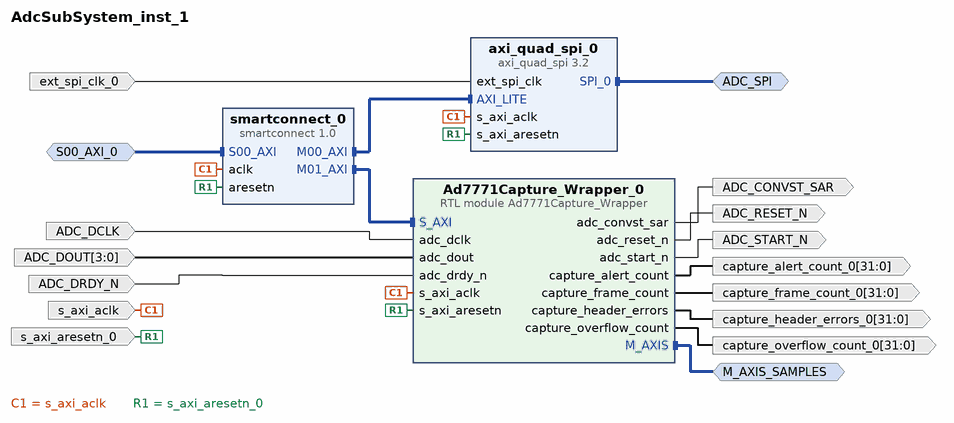
[diagram p0: block diagram of the top level]
# Vivado block design AdcSubSystem_inst_1, xck26-sfvc784-2LV-c, Vivado 2025.2
create_bd_design AdcSubSystem_inst_1

create_bd_intf_port -mode Master -vlnv xilinx.com:interface:spi_rtl:1.0 ADC_SPI
create_bd_intf_port -mode Slave -vlnv xilinx.com:interface:aximm_rtl:1.0 S00_AXI_0
create_bd_intf_port -mode Master -vlnv xilinx.com:interface:axis_rtl:1.0 M_AXIS_SAMPLES
create_bd_port -dir I -type clk ext_spi_clk_0
create_bd_port -dir I -type rst s_axi_aresetn_0
create_bd_port -dir I -type clk s_axi_aclk
create_bd_port -dir I -type clk ADC_DCLK
create_bd_port -dir I ADC_DRDY_N
create_bd_port -dir I -from 3 -to 0 ADC_DOUT
create_bd_port -dir O ADC_RESET_N
create_bd_port -dir O ADC_START_N
create_bd_port -dir O ADC_CONVST_SAR
create_bd_port -dir O -from 31 -to 0 capture_frame_count_0
create_bd_port -dir O -from 31 -to 0 capture_overflow_count_0
create_bd_port -dir O -from 31 -to 0 capture_header_errors_0
create_bd_port -dir O -from 31 -to 0 capture_alert_count_0

create_bd_cell -type ip -vlnv xilinx.com:ip:smartconnect:1.0 smartconnect_0
set_property -dict {CONFIG.NUM_MI 2 CONFIG.NUM_SI 1} [get_bd_cells smartconnect_0]
create_bd_cell -type ip -vlnv xilinx.com:ip:axi_quad_spi:3.2 axi_quad_spi_0
set_property -dict {CONFIG.QSPI_BOARD_INTERFACE Custom CONFIG.USE_BOARD_FLOW true} [get_bd_cells axi_quad_spi_0]
create_bd_cell -type module -reference Ad7771Capture_Wrapper Ad7771Capture_Wrapper_0

# ---- connections ----

connect_bd_intf_net [get_bd_intf_ports M_AXIS_SAMPLES] [get_bd_intf_pins Ad7771Capture_Wrapper_0/M_AXIS]
connect_bd_intf_net -intf_net S00_AXI_0_1 [get_bd_intf_ports S00_AXI_0] [get_bd_intf_pins smartconnect_0/S00_AXI]
connect_bd_intf_net [get_bd_intf_ports ADC_SPI] [get_bd_intf_pins axi_quad_spi_0/SPI_0]
connect_bd_intf_net [get_bd_intf_pins smartconnect_0/M00_AXI] [get_bd_intf_pins axi_quad_spi_0/AXI_LITE]
connect_bd_intf_net [get_bd_intf_pins smartconnect_0/M01_AXI] [get_bd_intf_pins Ad7771Capture_Wrapper_0/S_AXI]
connect_bd_net [get_bd_ports ADC_DCLK] [get_bd_pins Ad7771Capture_Wrapper_0/adc_dclk]
connect_bd_net [get_bd_ports ADC_DOUT] [get_bd_pins Ad7771Capture_Wrapper_0/adc_dout]
connect_bd_net [get_bd_ports ADC_DRDY_N] [get_bd_pins Ad7771Capture_Wrapper_0/adc_drdy_n]
connect_bd_net [get_bd_pins Ad7771Capture_Wrapper_0/adc_convst_sar] [get_bd_ports ADC_CONVST_SAR]
connect_bd_net [get_bd_pins Ad7771Capture_Wrapper_0/adc_reset_n] [get_bd_ports ADC_RESET_N]
connect_bd_net [get_bd_pins Ad7771Capture_Wrapper_0/adc_start_n] [get_bd_ports ADC_START_N]
connect_bd_net [get_bd_pins Ad7771Capture_Wrapper_0/capture_alert_count] [get_bd_ports capture_alert_count_0]
connect_bd_net [get_bd_pins Ad7771Capture_Wrapper_0/capture_frame_count] [get_bd_ports capture_frame_count_0]
connect_bd_net [get_bd_pins Ad7771Capture_Wrapper_0/capture_header_errors] [get_bd_ports capture_header_errors_0]
connect_bd_net [get_bd_pins Ad7771Capture_Wrapper_0/capture_overflow_count] [get_bd_ports capture_overflow_count_0]
connect_bd_net -net aclk_0_1 [get_bd_ports s_axi_aclk] \
  [get_bd_pins smartconnect_0/aclk] [get_bd_pins axi_quad_spi_0/s_axi_aclk] [get_bd_pins Ad7771Capture_Wrapper_0/s_axi_aclk]
connect_bd_net -net ext_spi_clk_0_1 [get_bd_ports ext_spi_clk_0] [get_bd_pins axi_quad_spi_0/ext_spi_clk]
connect_bd_net -net s_axi_aresetn_0_1 [get_bd_ports s_axi_aresetn_0] \
  [get_bd_pins axi_quad_spi_0/s_axi_aresetn] [get_bd_pins smartconnect_0/aresetn] \
  [get_bd_pins Ad7771Capture_Wrapper_0/s_axi_aresetn]

# ---- address map ----
assign_bd_address -offset 0xB0010000 -range 64K -target_address_space [get_bd_addr_spaces S00_AXI_0] [get_bd_addr_segs axi_quad_spi_0/AXI_LITE/Reg]
assign_bd_address -offset 0xB0010000 -range 64K -target_address_space [get_bd_addr_spaces S00_AXI_0] [get_bd_addr_segs axi_quad_spi_0/AXI_LITE/Reg]
assign_bd_address -offset 0xB0020000 -range 4K -target_address_space [get_bd_addr_spaces S00_AXI_0] [get_bd_addr_segs Ad7771Capture_Wrapper_0/S_AXI/reg0]
assign_bd_address -offset 0xB0020000 -range 4K -target_address_space [get_bd_addr_spaces S00_AXI_0] [get_bd_addr_segs Ad7771Capture_Wrapper_0/S_AXI/reg0]

validate_bd_design
save_bd_design
